# EAGLE design relay_driver (EAGLE 7.0.0)
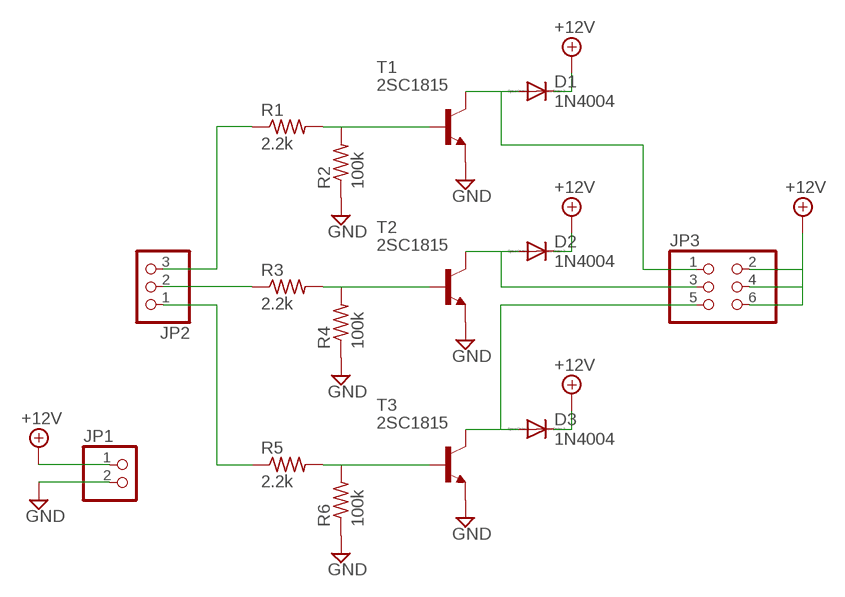
[diagram p0: schematic, sheet 1]

## Parts
D1  1N4004  [DO41-10]
D2  1N4004  [DO41-10]
D3  1N4004  [DO41-10]
JP1  PINHD-1X2  [1X02]
JP2  PINHD-1X3  [1X03]
JP3  PINHD-2X3  [2X03]
R1  2.2k  R-US_0204/7  [0204/7]
R2  100k  R-US_0204/7  [0204/7]
R3  2.2k  R-US_0204/7  [0204/7]
R4  100k  R-US_0204/7  [0204/7]
R5  2.2k  R-US_0204/7  [0204/7]
R6  100k  R-US_0204/7  [0204/7]
T1  2SC1815  [TO92-ECB]
T2  2SC1815  [TO92-ECB]
T3  2SC1815  [TO92-ECB]

## Nets
+12V: D1.C D2.C D3.C JP1.1 JP3.2 JP3.4 JP3.6
GND: JP1.2 R2.1 R4.1 R6.1 T1.E T2.E T3.E
N$1: R1.2 R2.2 T1.B
N$2: R3.2 R4.2 T2.B
N$3: R5.2 R6.2 T3.B
N$4: JP2.2 R3.1
N$5: JP2.3 R1.1
N$6: JP2.1 R5.1
N$7: D1.A JP3.1 T1.C
N$8: D2.A JP3.3 T2.C
N$9: D3.A JP3.5 T3.C

## Library data of the parts
D1-D3 = diode:1N4004: DIODE general purpose rectifier, 1 A
JP1 = pinhead:PINHD-1X2: PIN HEADER
JP2 = pinhead:PINHD-1X3: PIN HEADER
JP3 = pinhead:PINHD-2X3: PIN HEADER
R1-R6 = rcl:R-US_: RESISTOR, American symbol
T1-T3 = transistor:2SC1815: NPN EPITAXIAL TRANSISTOR Source: TOSHIBA .. 2SC1815 1.pdf

## Board
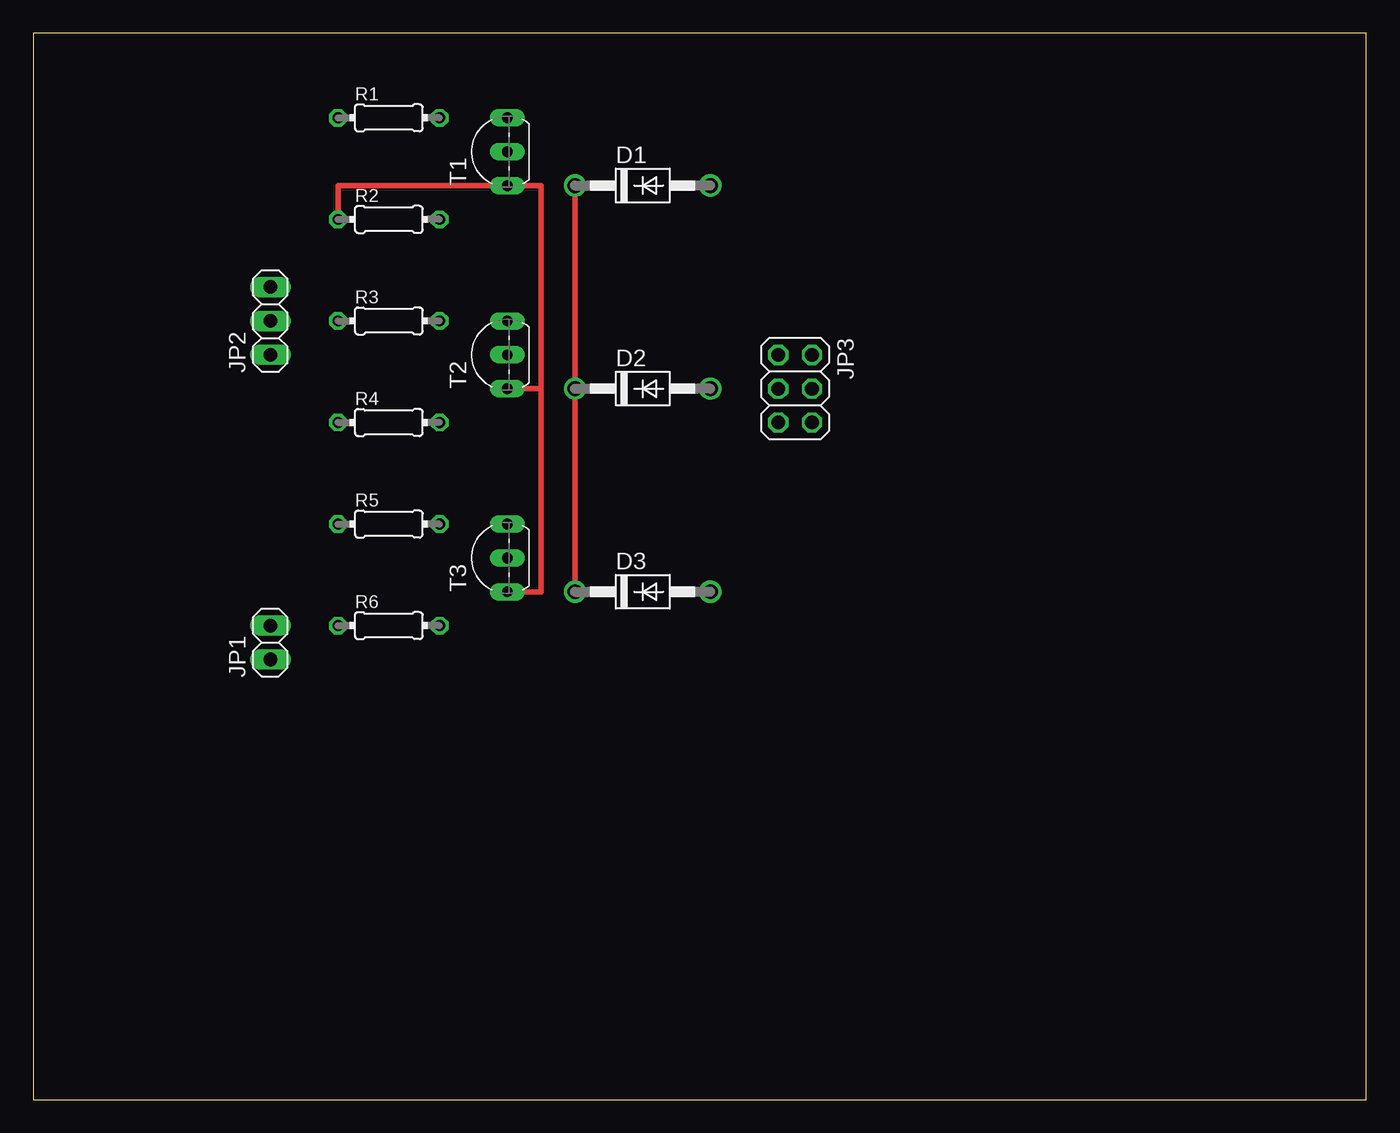
[diagram p1: board, top side]
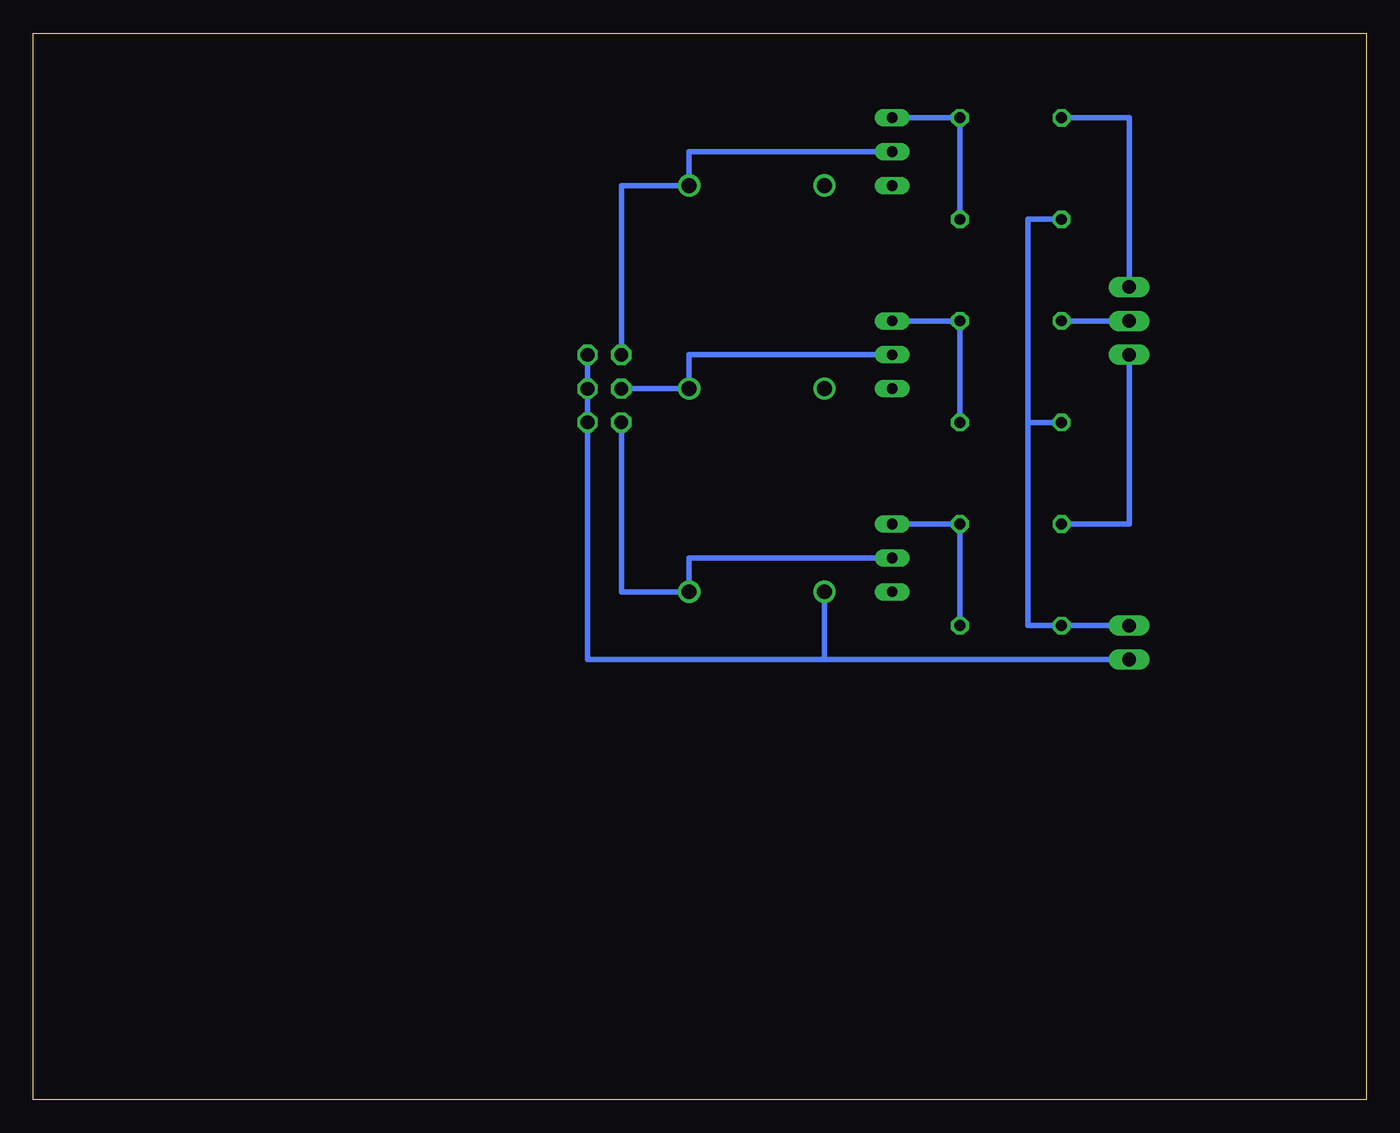
[diagram p2: board, bottom side, seen from below]

Size 100 x 80 mm. Coordinates in mm from the lower left corner, seen from the top.
Outline: 0,0 100,0 100,80 0,80 0,0
Copper layers (1*16): Top 0.035mm / dielectric 1.5mm / Bottom 0.035mm
Design rules "default": minimum track width 10mil, minimum drill 24mil, track to track 8mil, track to pad 8mil, pad to pad 8mil, via to via 8mil, smd to smd 8mil, copper to edge 40mil, drill to drill 8mil, minimum pad ring 10mil, minimum via ring 8mil, stop-mask expansion 4mil, vias tented up to drill 0mil, thermal gap 10mil

### Footprints (pad centres in the part's own frame; a part is rotated, then mirrored left to right if it is on the bottom)
DO41-10 = drill 1.118: A 5.08,0; C -5.08,0
1X02 = drill 1.016 long: 1 -1.27,0; 2 1.27,0
1X03 = drill 1.016 long: 1 -2.54,0; 2 0,0; 3 2.54,0
2X03 = drill 1.016 octagon: 1 -2.54,-1.27; 2 -2.54,1.27; 3 0,-1.27; 4 0,1.27; 5 2.54,-1.27; 6 2.54,1.27
0204/7 = drill 0.813 octagon: 1 -3.81,0; 2 3.81,0
TO92-ECB = drill 0.813 long: B 2.54,0; C 0,0; E -2.54,0

### Placement (x,y rotation side)
D1  45.72,68.58 0 top
D2  45.72,53.34 0 top
D3  45.72,38.1 0 top
JP1  17.78,34.29 90 top
JP2  17.78,58.42 90 top
JP3  57.15,53.34 270 top
R1  26.67,73.66 0 top
R2  26.67,66.04 0 top
R3  26.67,58.42 0 top
R4  26.67,50.8 0 top
R5  26.67,43.18 0 top
R6  26.67,35.56 0 top
T1  35.56,71.12 90 top
T2  35.56,55.88 90 top
T3  35.56,40.64 90 top

### Tracks (layer width: path | path; a pad name or v marks a point on that pad's centre or on a via)
+12V
  Top 0.406: D1.C D2.C D3.C
  Bottom 0.406: JP3.2 JP3.4 | JP3.4 JP3.6 | JP1.1 40.64,33.02 | JP3.4 58.42,33.02 40.64,33.02 | 40.64,33.02 D3.C
GND
  Top 0.406: 38.1,53.34 38.1,68.58 T1.E 22.86,68.58 R2.1 | T2.E 38.1,53.34 | 38.1,53.34 38.1,38.1 T3.E
  Bottom 0.406: R2.1 25.4,66.04 25.4,50.8 | R4.1 25.4,50.8 | 25.4,50.8 25.4,35.56 R6.1 JP1.2
N$1
  Bottom 0.406: T1.B R1.2 R2.2
N$2
  Bottom 0.406: T2.B R3.2 R4.2
N$3
  Bottom 0.406: T3.B R5.2 R6.2
N$4
  Bottom 0.406: JP2.2 R3.1
N$5
  Bottom 0.406: JP2.3 17.78,73.66 R1.1
N$6
  Bottom 0.406: JP2.1 17.78,43.18 R5.1
N$7
  Bottom 0.406: T1.C 50.8,71.12 D1.A 55.88,68.58 JP3.1
N$8
  Bottom 0.406: T2.C 50.8,55.88 D2.A JP3.3
N$9
  Bottom 0.406: T3.C 50.8,40.64 D3.A 55.88,38.1 JP3.5